# Altium schematic sheet LED_280x10.SchDoc: LED Strip
size A
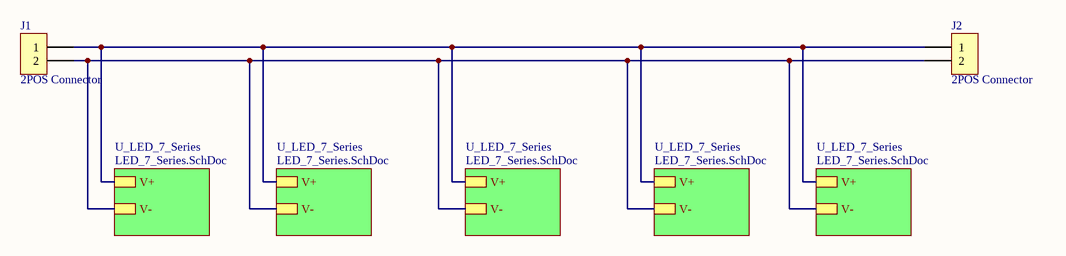
[diagram p0: LED_280x10.SchDoc]

## Parts
J1  2POS Connector  [2 POS PADs]
J2  2POS Connector  [2 POS PADs]

## Sub-sheets
U_LED_7_Series = LED_7_Series.SchDoc: V+, V-
U_LED_7_Series = LED_7_Series.SchDoc: V+, V-
U_LED_7_Series = LED_7_Series.SchDoc: V+, V-
U_LED_7_Series = LED_7_Series.SchDoc: V+, V-
U_LED_7_Series = LED_7_Series.SchDoc: V+, V-

## Nets
NetJ1_1: J1.1 J2.1 ; sheet U_LED_7_Series/V+, sheet U_LED_7_Series/V+, sheet U_LED_7_Series/V+, sheet U_LED_7_Series/V+, sheet U_LED_7_Series/V+
NetJ1_2: J1.2 J2.2 ; sheet U_LED_7_Series/V-, sheet U_LED_7_Series/V-, sheet U_LED_7_Series/V-, sheet U_LED_7_Series/V-, sheet U_LED_7_Series/V-